# Altium project Rectifier.PrjPcb
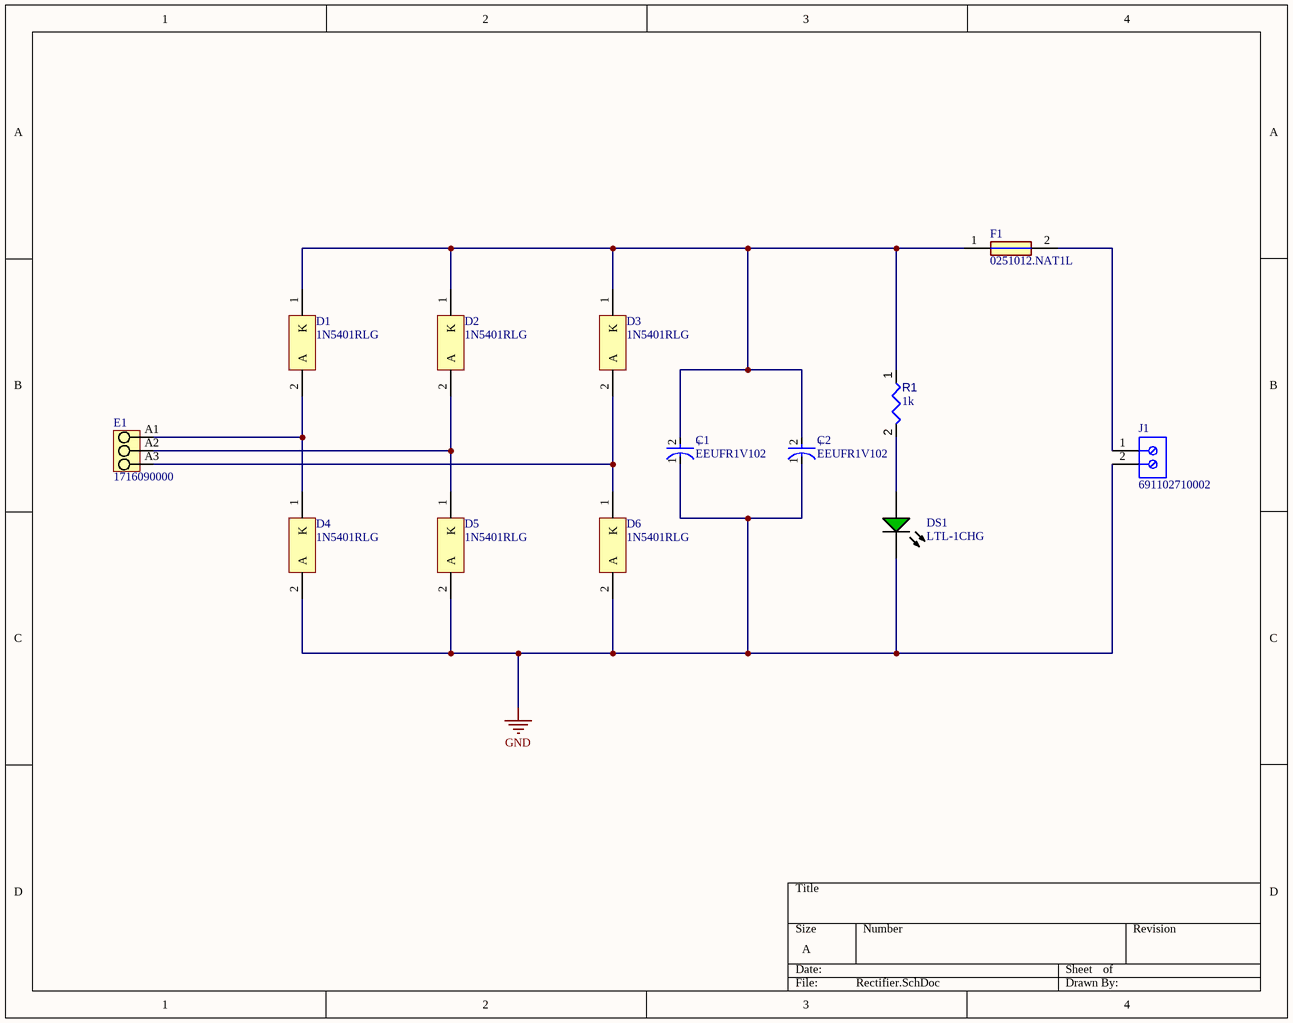
[diagram p0: Rectifier.SchDoc]
1 sheet, 13 parts. Net scope: global (net labels, ports and power ports of the same name join across sheets).
Board file: Rectifier.PcbDoc

## Sheet Rectifier.SchDoc
size A; SheetNumber: 1; SheetTotal: 1

### Parts
C1  EEUFR1V102  [FP-RAD-TH-D_12_5_0_5-L_20-MFG]
C2  EEUFR1V102  [FP-RAD-TH-D_12_5_0_5-L_20-MFG]
D1  1N5401RLG  [ONSC-AXIAL_LEAD-2-267-05_V]
D2  1N5401RLG  [ONSC-AXIAL_LEAD-2-267-05_V]
D3  1N5401RLG  [ONSC-AXIAL_LEAD-2-267-05_V]
D4  1N5401RLG  [ONSC-AXIAL_LEAD-2-267-05_V]
D5  1N5401RLG  [ONSC-AXIAL_LEAD-2-267-05_V]
D6  1N5401RLG  [ONSC-AXIAL_LEAD-2-267-05_V]
DS1  LTL-1CHG  [LTST-LTL-1CHG-2]
E1  1716090000  [LM_5_08_90_03]
F1  0251012.NAT1L  [0251012NAT1L]
J1  691102710002  [691102710002]
R1  value 1k  [RESA60-630X240]  (hidden comment: MFR-25FBF52-1K)

### Nets
GND: C1.1(C) C2.1(C) D4.2(A) D5.2(A) D6.2(A) DS1.2(K) J1.2
NetC1_2: C1.2(A) C2.2(A) D1.1(K) D2.1(K) D3.1(K) F1.1 R1.1
NetD1_2: D1.2(A) D4.1(K) E1.A1
NetD2_2: D2.2(A) D5.1(K) E1.A2
NetD3_2: D3.2(A) D6.1(K) E1.A3
NetDS1_1: DS1.1(A) R1.2
NetF1_2: F1.2 J1.1

### Notes on the sheet
- (in symbol CMP-05427-000195-1) +

### Library data of the parts
C1 C2 = CMP-05427-000195-1: Aluminum Electrolytic Capacitors (Radial Lead Type) 1000uF ±20% 35V; Ripple Current (AC): 2.6A; Polarity: Polar; Capacitance: 1mF; Life (Hours): 10000Hour; Lead Diameter: 0.6mm; Lead/Base Style: Straight; Impedance: 18mR; Lead Free: Lead Free; Voltage Rating (DC): 35V; Construction: RADIAL; RoHS Compliant: Yes; Termination: Radial; Ripple Current: 2.6A; Tolerance: 20%; Voltage Rating: 35V; Height - Seated (Max): 0.866inch; Voltage: 35V; Series: FR; Height: 20mm; Min Operating Temperature: -40°C; Diameter: 12.5mm; Lead Pitch: 5mm; Package Quantity: 200; Radiation Hardening: No; Mount: Through Hole; Case/Package: Radial; Packaging: Bulk; Length: 20mm; Number of Pins: 2; Max Operating Temperature: 105°C; ESR (Equivalent Series Resistance): 18mR; Contact Plating: Tin
D1-D6 = CMP-0902-00079-1: Standard Recovery Rectifier, 2-Pin Axial_Lead, Pb-Free, Tape and Reel; Manufacturer: On Semiconductor; VRRM Max (V): 100; IO(rec) Max (A): 3; IFSM Max (A): 200; Packing: Tape and Reel; PackageVersion: Rev. G, 06/2000; Mounting Technology: Through Hole; PartNumber: 1N5401RLG; ComponentLink2URL: http://www.onsemi.com/pub_link/Collateral/1N5400-D.PDF; ComponentLink1Description: Manufacturer URL; DatasheetVersion: Rev. 10; PackageDescription: 2-Pin, Axial Lead, Diameter 5.05 mm; ComponentLink1URL: http://www.onsemi.com/; ComponentLink3URL: http://www.onsemi.com/pub_link/Collateral/267-05.PDF; ComponentLink2Description: Datasheet; ComponentLink3Description: Package Specification; PackageReference: AXIAL_LEAD-2-267-05; RoHS: TRUE; Type: Standard Recovery
DS1 = CMP-007-00019-2: LED Uni-Color Green, 100 mW, 30 mA, -55 to 100 degC, 2-Pin THD, RoHS, Bulk; Manufacturer: Lite-On; Power: 100mW; Forward Voltage: 2.6V; Forward Current: 30mA; Nominal Vf: 2.1V; Lens Style: Dome; Viewing Angle: 60degrees; Luminous Intensity: 12.6mcd; Max Operating Temperature: 100°C; Case/Package: Radial; Package Reference: LTL-1CHG; Manufacturer URL: http://www.us.liteon.com/; Package Quantity: 1000; Colour: Green; Packaging: Bulk; RoHS Compliant: True; Datasheet URL: http://datasheet.octopart.com/LTL-1CHG-Lite-On-datasheet-143841.pdf; Package Description: 2-Pin Through Hole Device, Dia 3.8 mm; Min Operating Temperature: -55°C; Mounting Technology: TH; Pins: 2; Illumination Colour: Green; Datasheet Version: Mar-00
E1 = CMP-1559-01768-1: OMNIMATE Signal - series LM; Manufacturer: Weidmueller; Contact_surface: tinned; Pitch_mm: 5,08 mm; Solder_pin_length_mm: 3,5 mm; Contact_material: Cu-Leg; Wire_cross_section_AWG_min_UL_1059: AWG 24; Solid_min_H05_07_V_U: 0,2 mm²; Insulating_material: Wemid (PA); Solid_max_H05_07_V_U: 2,5 mm²; Pitch_inch: 0,2 inch; Wire_cross_section_AWG_max_UL_1059: AWG 14; UL_94_flammability_rating: V-0; No_of_poles: 3; Rated_voltage_use_group_B_UL_1059: 300 V; Mounting_onto_the_PCB: Solder connection; Side_termination_characteristic: closed side; Short_text_for_material: LM 5.08/03/90 3.5SN OR BX; Rated_current_use_group_B_UL_1059: 15 A; Rated_voltage_for_surge_voltage_class_pollution_degree_II_2: 630 V; Revision: V1; ComponentLink2URL: http://catalog.weidmueller.com/catalog/Start.do?localeId=en&ObjectID=1716090000; Colour: Orange; PackageReference: LM_5_08_90_03; ComponentLink1Description: Manufacturer URL; ComponentLink2Description: URL Link1; ComponentLink1URL: http://www.weidmueller.com/; Qty: 500 PCS; PartNumber: 1716090000; Packaging: Box
F1 = 0251012.NAT1L: Fuse; Manufacturer_Name: LITTELFUSE; Datasheet Link: https://www.jameco.com/Jameco/Products/ProdDS/1710451.pdf; Height: 2.8mm; Manufacturer_Part_Number: 0251012.NAT1L
J1 = CMP-1502-03258-1: Series 102 - 5.00 mm Horizontal Entry Modular with Pressure Clamp WR-TBL, 2 pin; Manufacturer: Wurth Elektronik; Pin Number: 2; Pitch: 5.00mm; Manufacturer URL: http://www.we-online.de; Mounting Technology: THT; Publisher: WurthElektronik; Packaging: Box; Package Reference: 691102710002; Datasheet URL: http://katalog.we-online.de/em/datasheet/6911027100xx.pdf; Operating Temperature: -40to105degC; Part Number: 691102710002
R1 = CMP-009-00048-4: Axial Resistor, 1 KOhm, +/- 1%, 250 mW, -55 to 155 degC, 2-Pin THD, RoHS, Bulk; Manufacturer: Yageo; Voltage Rating: 250V; Power: 250mW; Min Operating Temperature: -55°C; Max Operating Temperature: 155°C; Tolerance: 1%; Package Reference: MFR-25; Composition: CarbonFilm; Mounting Technology: TH; Packaging: Bulk; Case/Package: Axial; Datasheet URL: http://www.yageo.com/documents/recent/Yageo%20LR_MFR_2013.pdf; Package Quantity: 200; Manufacturer URL: http://www.yageo.com/; Package Description: 2-Pin Axial Lead, Dia 2.4 mm, Body Length 6.3 mm; Datasheet Version: Apr-13; RoHS Compliant: True